# EasyEDA Pro project ProPrj_4足轮足机器蜘蛛_2024-09-02.epro, schematic 核心板
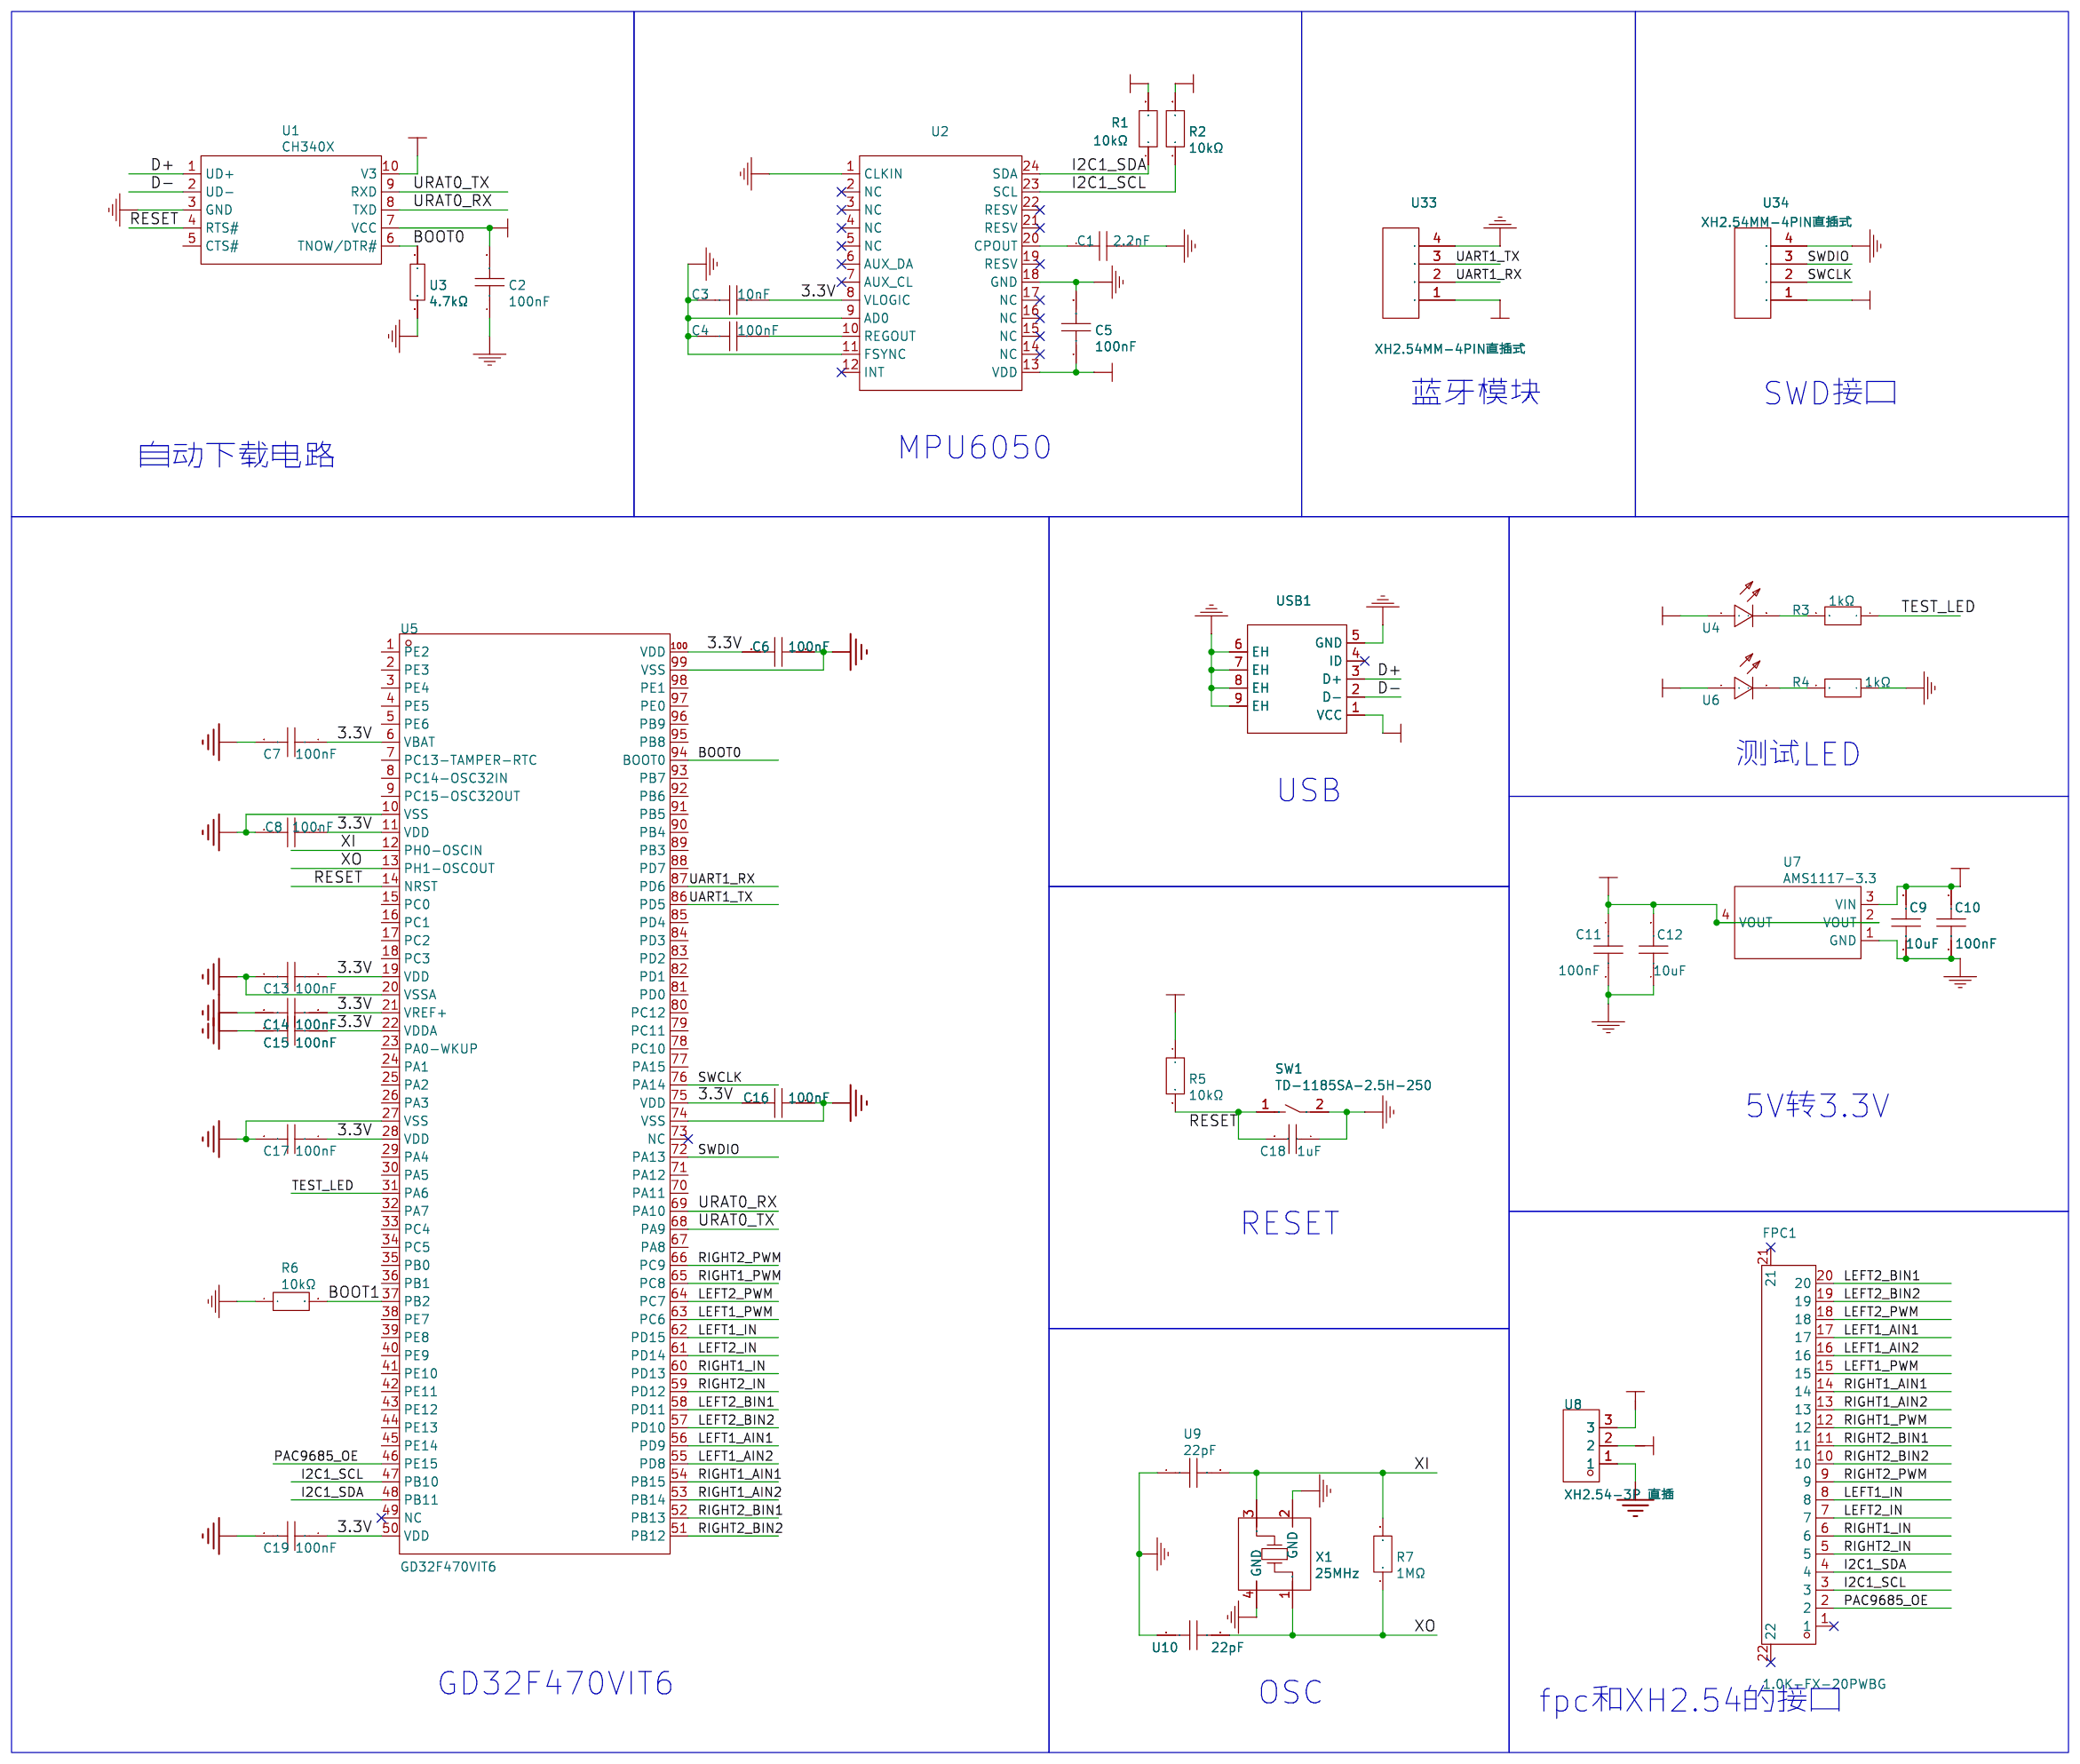
[diagram p0: schematic sheet]

## Parts
C1  2.2nF  [C0603]
C2  100nF  [C0603]
C3  10nF  [C0603]
C4  100nF  [C0603]
C5  100nF  [C0603]
C6  100nF  [C0603]
C7  100nF  [C0603]
C8  100nF  [C0603]
C9  10uF  [C0603]
C10  100nF  [C0603]
C11  100nF  [C0603]
C12  10uF  [C0603]
C13  100nF  [C0603]
C14  100nF  [C0603]
C15  100nF  [C0603]
C16  100nF  [C0603]
C17  100nF  [C0603]
C18  1uF  [C0603]
C19  100nF  [C0603]
FPC1  1.0K-FX-20PWBG  [FPC-SMD_20P-P1.00-HDGE_1.0K-FX-20PWBG]
R1  10kΩ  [R0603]
R2  10kΩ  [R0603]
R3  1kΩ  [R0603]
R4  1kΩ  [R0603]
R5  10kΩ  [R0603]
R6  10kΩ  [R0603]
R7  1MΩ  [R0603]
SW1  TD-1185SA-2.5H-250  [SW-SMD_L4.0-W2.9-LS5.0]
U1  CH340X  [MSOP-10_L3.0-W3.0-P0.50-LS5.0-BL]
U2  MPU6050_C9900042518  [QFN-24_L4.0-W4.0-P0.50-BL]
U3  4.7kΩ  [R0603]
U4  LED0603B_C9900017731  [LED0603_BLUE]
U5  GD32F470VIT6  [LQFP-100_L14.0-W14.0-P0.50-LS16.0-BL]
U6  LED0603B_C9900017731  [LED0603_BLUE]
U7  AMS1117-3.3  [SOT-223-3_L6.5-W3.4-P2.30-LS7.0-BR]
U8  XH2.54-3P 直插  [CONN-TH_XH2.54-3P]
U9  22pF  [C0603]
U10  22pF  [C0603]
U33  XH2.54MM-4PIN直插式  [XH2.54MM-4PIN]
U34  XH2.54MM-4PIN直插式  [XH2.54MM-4PIN]
USB1  USB-MICRO XNJ JB  [MICRO-USB-SMD_HX-USB-MICRO-XNJ-JB]
X1  25MHz  [OSC-SMD_4P-L3.2-W2.5-BL]

## Library data of the parts
C1 = 2.2nF: Supplier: LCSC; Supplier Part: C346189; Manufacturer: SAMSUNG(三星); Manufacturer Part: CL10B104KA8NFNC; JLCPCB Part Class: Extended Part
C2 C4-C8 C10 C11 C13-C17 C19 = 100nF: Supplier: LCSC; Supplier Part: C346189; Manufacturer: SAMSUNG(三星); Manufacturer Part: CL10B104KA8NFNC; JLCPCB Part Class: Extended Part
C3 = 10nF: Supplier: LCSC; Supplier Part: C346189; Manufacturer: SAMSUNG(三星); Manufacturer Part: CL10B104KA8NFNC; JLCPCB Part Class: Extended Part
C9 C12 = 10uF: Supplier: LCSC; Supplier Part: C7472959; Manufacturer: Chinocera(华瓷); Manufacturer Part: HGC0603R5106M160NTHJ; JLCPCB Part Class: Extended Part
C18 = 1uF: Supplier: LCSC; Manufacturer: YAGEO(国巨); Manufacturer Part: CC0805ZRY5V8BB105; Supplier Part: C106837; JLCPCB Part Class: Extended Part
FPC1 = 1.0K-FX-20PWBG: 锁定特性:抽屉式;触点类型:下接;触点数量:20P;间距:1mm;安装类型:卧贴;工作温度范围:-20℃~+85℃;; LCSC Part Name: 间距:1mm P数:20P 抽屉式 下接; Supplier Part: C2914107; Manufacturer: HDGC(华德共创); Supplier Footprint: SMD,P=1mm,卧贴; JLCPCB Part Class: 扩展库; Datasheet: https://atta.szlcsc.com/upload/public/pdf/source/20211102/FBD3A65A951C668C1EEFFBD9B352F09A.pdf; Supplier: LCSC; Locking Feature: 抽屉式; Contact Type: 下接; Number of Contacts: 20P; Pitch: 1mm; Mounting Type: 卧贴; FFC, FCB Thickness: 0.3mm; Height Above Board: 2.5mm; Operating Temperature Range: -20℃~+85℃
R1 R2 = 10kΩ: Supplier: LCSC; Supplier Part: C782232; Manufacturer: KOA; Manufacturer Part: RN73H1JTTD1003B25; JLCPCB Part Class: Extended Part
R3 R4 = 1kΩ: Supplier: LCSC; Supplier Part: C782232; Manufacturer: KOA; Manufacturer Part: RN73H1JTTD1003B25
R5 R6 = 10kΩ: Supplier: LCSC; Supplier Part: C5141144; Manufacturer: RALEC(旺诠); Manufacturer Part: RTX031002DETP; JLCPCB Part Class: Extended Part
R7 = 1MΩ: Supplier: LCSC; Supplier Part: C5141144; Manufacturer: RALEC(旺诠); Manufacturer Part: RTX031002DETP; JLCPCB Part Class: Extended Part
SW1 = TD-1185SA-2.5H-250: Supplier: LCSC; Supplier Part: C2905175; Manufacturer: DEALON(德艺隆); JLCPCB Part Class: Extended Part
U1 = CH340X: Supplier: LCSC; Supplier Part: C3035748; Manufacturer: WCH(南京沁恒); JLCPCB Part Class: Extended Part
U2 = MPU6050_C9900042518: Supplier: LCSC; Supplier Part: C9900042518; Manufacturer: null; Manufacturer Part: MPU6050
U3 = 47kΩ: Supplier: LCSC; Supplier Part: C5139681; Manufacturer: RALEC(旺诠); Manufacturer Part: RAT03474JTP; JLCPCB Part Class: Extended Part
U4 U6 = LED0603B_C9900017731: Supplier: LCSC; Supplier Part: C9900017731; Manufacturer: null; Manufacturer Part: LED0603B
U5 = GD32F470VIT6: CPU内核:CM4;程序存储容量:2MB;RAM总容量:768KB;GPIO端口数量:82;工作电压范围:-;CPU最大主频:240MHz;程序存储器类型:FLASH;; Supplier Part: C3000495; Manufacturer: GigaDevice(兆易创新); Supplier Footprint: LQFP-100(14x14); JLCPCB Part Class: 扩展库; Datasheet: https://atta.szlcsc.com/upload/public/pdf/source/20220531/32C9833E8113AB84CC7F2DDE4C0EFA72.pdf; Supplier: LCSC; CPU Core: CM4; Program Storage Size: 2MB; RAM Size: 768KB; GPIO Ports Number: 82; CPU Maximum Speed: 240MHz; Program Memory Type: FLASH; ADC (Bit): 12bit; DAC (Bit): 12bit; 16Bit Timer: 12; 32Bit Timer: 2; CAN: 2; UART/USART: 8; I2C: 3; I2S: 2; SPI: 5; Universal Serial Bus: 有; Peripheral/Function: 看门狗；LCD/LED驱动；SDIO；RTC实时时钟; Watchdog: 有; Real-Time Clock: 有; Secure Digital Input and Output: 有
U7 = AMS1117-3.3: Supplier: LCSC; Manufacturer: AMS; Supplier Part: C6186; JLCPCB Part Class: Basic Part
U8 = XH2.54-3P 直插: Supplier Part: C9900000727; Supplier Footprint: TH-3_5.8X10.0X2.54P; JLCPCB Part Class: 扩展库; Supplier: LCSC
U9 U10 = 22pF: Supplier: LCSC; Supplier Part: C2168907; Manufacturer: Kyocera AVX; Manufacturer Part: 06033A220JAT2A; JLCPCB Part Class: Extended Part
U33 U34 = XH2.54MM-4PIN直插式
USB1 = USB-MICRO XNJ JB: Supplier: LCSC; Supplier Part: C7507410; Manufacturer: SHOU HAN(首韩); JLCPCB Part Class: Extended Part
X1 = 25MHz: Supplier: LCSC; Supplier Part: C431157; Manufacturer: YL(惠伦晶体); Manufacturer Part: 3S25000181; JLCPCB Part Class: Extended Part

## Nets
3.3V: C2.2 C3.2 C5.1 C6.1 C7.1 C8.1 C11.1 C12.2 C13.1 C14.1 C15.1 C16.1 C17.1 C19.1 R1.2 R2.2 R5.1 U1.7(VCC) U1.10(V3) U2.8(VLOGIC) U2.13(VDD) U4.1(A) U5.6(VBAT) U5.11(VDD) U5.19(VDD) U5.21(VREF+) U5.22(VDDA) U5.28(VDD) U5.50(VDD) U5.75(VDD) U5.100(VDD) U6.1(A) U7.2(VOUT) U7.4(VOUT) U8.2 U33.1 U34.1
5V: U8.3
GND: C1.2 C2.1 C3.1 C4.1 C5.2 C6.2 C7.2 C8.2 C9.1 C10.2 C11.2 C12.1 C13.2 C14.2 C15.2 C16.2 C17.2 C18.1 C19.2 R4.1 R6.1 SW1.2 U1.3(GND) U2.1(CLKIN) U2.9(AD0) U2.11(FSYNC) U2.18(GND) U3.2 U5.10(VSS) U5.20(VSSA) U5.27(VSS) U5.74(VSS) U5.99(VSS) U7.1(GND) U8.1 U9.1 U10.1 U33.4 U34.4 USB1.5(GND) USB1.6(EH) USB1.7(EH) USB1.8(EH) USB1.9(EH) X1.2(GND) X1.4(GND)
VBUS: C9.2 C10.1 U7.3(VIN) USB1.1(VCC)
BOOT0: U1.6(TNOW/DTR#) U3.1 U5.94(BOOT0)
BOOT1: R6.2 U5.37(PB2)
D+: U1.1(UD+) USB1.3(D+)
D-: U1.2(UD-) USB1.2(D-)
I2C1_SCL: FPC1.3 R2.1 U2.23(SCL) U5.47(PB10)
I2C1_SDA: FPC1.4 R1.1 U2.24(SDA) U5.48(PB11)
LEFT1_AIN1: FPC1.17 U5.56(PD9)
LEFT1_AIN2: FPC1.16 U5.55(PD8)
LEFT1_IN: FPC1.8 U5.62(PD15)
LEFT1_PWM: FPC1.15 U5.63(PC6)
LEFT2_BIN1: FPC1.20 U5.58(PD11)
LEFT2_BIN2: FPC1.19 U5.57(PD10)
LEFT2_IN: FPC1.7 U5.61(PD14)
LEFT2_PWM: FPC1.18 U5.64(PC7)
PAC9685_OE: FPC1.2 U5.46(PE15)
RESET: C18.2 R5.2 SW1.1 U1.4(RTS#) U5.14(NRST)
RIGHT1_AIN1: FPC1.14 U5.54(PB15)
RIGHT1_AIN2: FPC1.13 U5.53(PB14)
RIGHT1_IN: FPC1.6 U5.60(PD13)
RIGHT1_PWM: FPC1.12 U5.65(PC8)
RIGHT2_BIN1: FPC1.11 U5.52(PB13)
RIGHT2_BIN2: FPC1.10 U5.51(PB12)
RIGHT2_IN: FPC1.5 U5.59(PD12)
RIGHT2_PWM: FPC1.9 U5.66(PC9)
SWCLK: U5.76(PA14) U34.2
SWDIO: U5.72(PA13) U34.3
TEST_LED: R3.1 U5.31(PA6)
UART1_RX: U5.87(PD6) U33.2
UART1_TX: U5.86(PD5) U33.3
URAT0_RX: U1.8(TXD) U5.69(PA10)
URAT0_TX: U1.9(RXD) U5.68(PA9)
XI: R7.2 U5.12(PH0-OSCIN) U9.2 X1.3
XO: R7.1 U5.13(PH1-OSCOUT) U10.2 X1.1
$1N2326: R3.2 U4.2(K)
$1N2866: C1.1 U2.20(CPOUT)
$1N2867: C4.2 U2.10(REGOUT)
$1N2956: R4.2 U6.2(K)

Not connected (* = marked no-connect by the designer): FPC1 1* 21* 22*; U1 5(CTS#); U2 2(NC)* 3(NC)* 4(NC)* 5(NC)* 6(AUX_DA)* 7(AUX_CL)* 12(INT)* 14(NC)* 15(NC)* 16(NC)* 17(NC)* 19(RESV)* 21(RESV)* 22(RESV)*; U5 1(PE2) 2(PE3) 3(PE4) 4(PE5) 5(PE6) 7(PC13-TAMPER-RTC) 8(PC14-OSC32IN) 9(PC15-OSC32OUT) 15(PC0) 16(PC1) 17(PC2) 18(PC3) 23(PA0-WKUP) 24(PA1) 25(PA2) 26(PA3) 29(PA4) 30(PA5) 32(PA7) 33(PC4) 34(PC5) 35(PB0) 36(PB1) 38(PE7) 39(PE8) 40(PE9) 41(PE10) 42(PE11) 43(PE12) 44(PE13) 45(PE14) 49(NC)* 67(PA8) 70(PA11) 71(PA12) 73(NC)* 77(PA15) 78(PC10) 79(PC11) 80(PC12) 81(PD0) 82(PD1) 83(PD2) 84(PD3) 85(PD4) 88(PD7) 89(PB3) 90(PB4) 91(PB5) 92(PB6) 93(PB7) 95(PB8) 96(PB9) 97(PE0) 98(PE1); USB1 4(ID)*

## Notes on the sheet
- 蓝牙模块
- SWD接口
- MPU6050
- 自动下载电路
- 测试LED
- USB
- 5V转3.3V
- RESET
- GD32F470VIT6
- fpc和XH2.54的接口
- OSC
